# Altium schematic sheet power.SchDoc
size A4
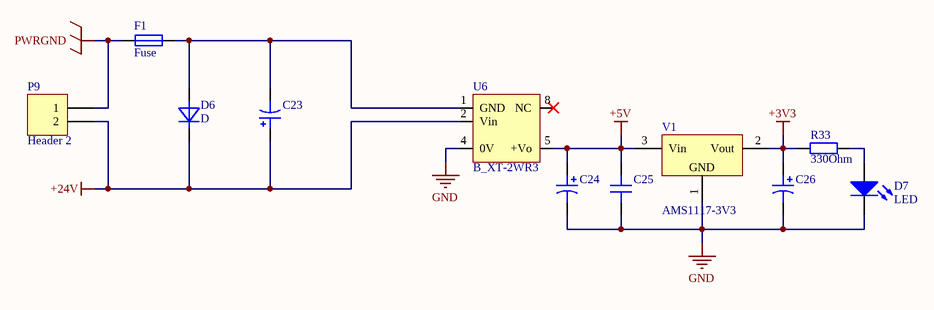
[diagram p0: power.SchDoc]

## Parts
C23  1uF  [TC3528-1411]  (value not drawn)
C24  10uF  [TC3528-1411]  (value not drawn)
C25  100nF  [CAP 0805]  (value not drawn)
C26  100uF  [TC7343-2917]  (value not drawn)
D6  D  [CD3216-1206]
D7  LED  [CD2012-0805]
F1  Fuse  [RES 1210]
P9  Header 2  [XT30PW-M]
R33  value 330Ohm  [RES 0805]  (hidden comment: Resistor)
U6  B_XT-2WR3  [B_XT-2WR3]
V1  AMS1117-3V3  [SOT-223]

## Nets
+3V3: C26.1 R33.1 V1.2(Vout)
+5V: C24.1 C25.2 U6.5(+Vo) V1.3(Vin)
+24V: C23.1 D6.2 P9.2 U6.2(Vin)
GND: C24.2 C25.1 C26.2 D7.2(K) U6.4(0V) V1.1(GND)
PWRGND: F1.1 P9.1
NetC23_2: C23.2 D6.1 F1.2 U6.1(GND)
NetD7_1: D7.1(A) R33.2

Not connected (* = marked no-connect by the designer): U6 8(NC)*

## Library data of the parts
C23 C24 C26 = Cap Pol: Capacitor; Published: 23-Sep-2002; PackageReference: CAPR5-4X5; Publisher: Altium Limited; PackageDescription: Capacitor; 2 Leads
C25 = Cap: Non-polar capacitor; Published: 8-Jun-2000; LatestRevisionDate: 17-Jul-2002; LatestRevisionNote: Re-released for DXP Platform.; PackageReference: RAD-0.3; Publisher: Altium Limited; PackageDescription: Radial Cap, Thru-Hole; 2 Leads; 0.3 in Pin Spacing
P9 = Header 2: Header, 2-Pin; LatestRevisionDate: 17-Jul-2002; LatestRevisionNote: Re-released for DXP Platform.; Publisher: Altium Limited
R33 = Res: Published: 8-Jun-2000; LatestRevisionDate: 17-Jul-2002; LatestRevisionNote: Re-released for DXP Platform.; PackageReference: AXIAL-0.4; Publisher: Altium Limited; PackageDescription: Axial Device, Thru-Hole; 2 Leads; 0.4 in Pin Spacing
V1 = AMS1117: 三端稳压芯片; BOM名称: 稳压芯片; 版权归属: 黎明电子style; 学习资源: https://lmdzstyle.taobao.com/
D7 = LED: Published: 8-Jun-2000; LatestRevisionDate: 08-Jul-2005; LatestRevisionNote: Mech Layer 1 removed.; PackageReference: LED-0; Publisher: Altium Limited; PackageDescription: LED; 2 Leads
F1 = Fuse: Published: 8-Jun-2000; LatestRevisionDate: 17-Jul-2002; LatestRevisionNote: Re-released for DXP Platform.; PackageReference: PIN-W2/E2.8; Publisher: Altium Limited; PackageDescription: Thru-Hole; 2 Leads